# Altium schematic sheet pwm_driver.SchDoc
size A4
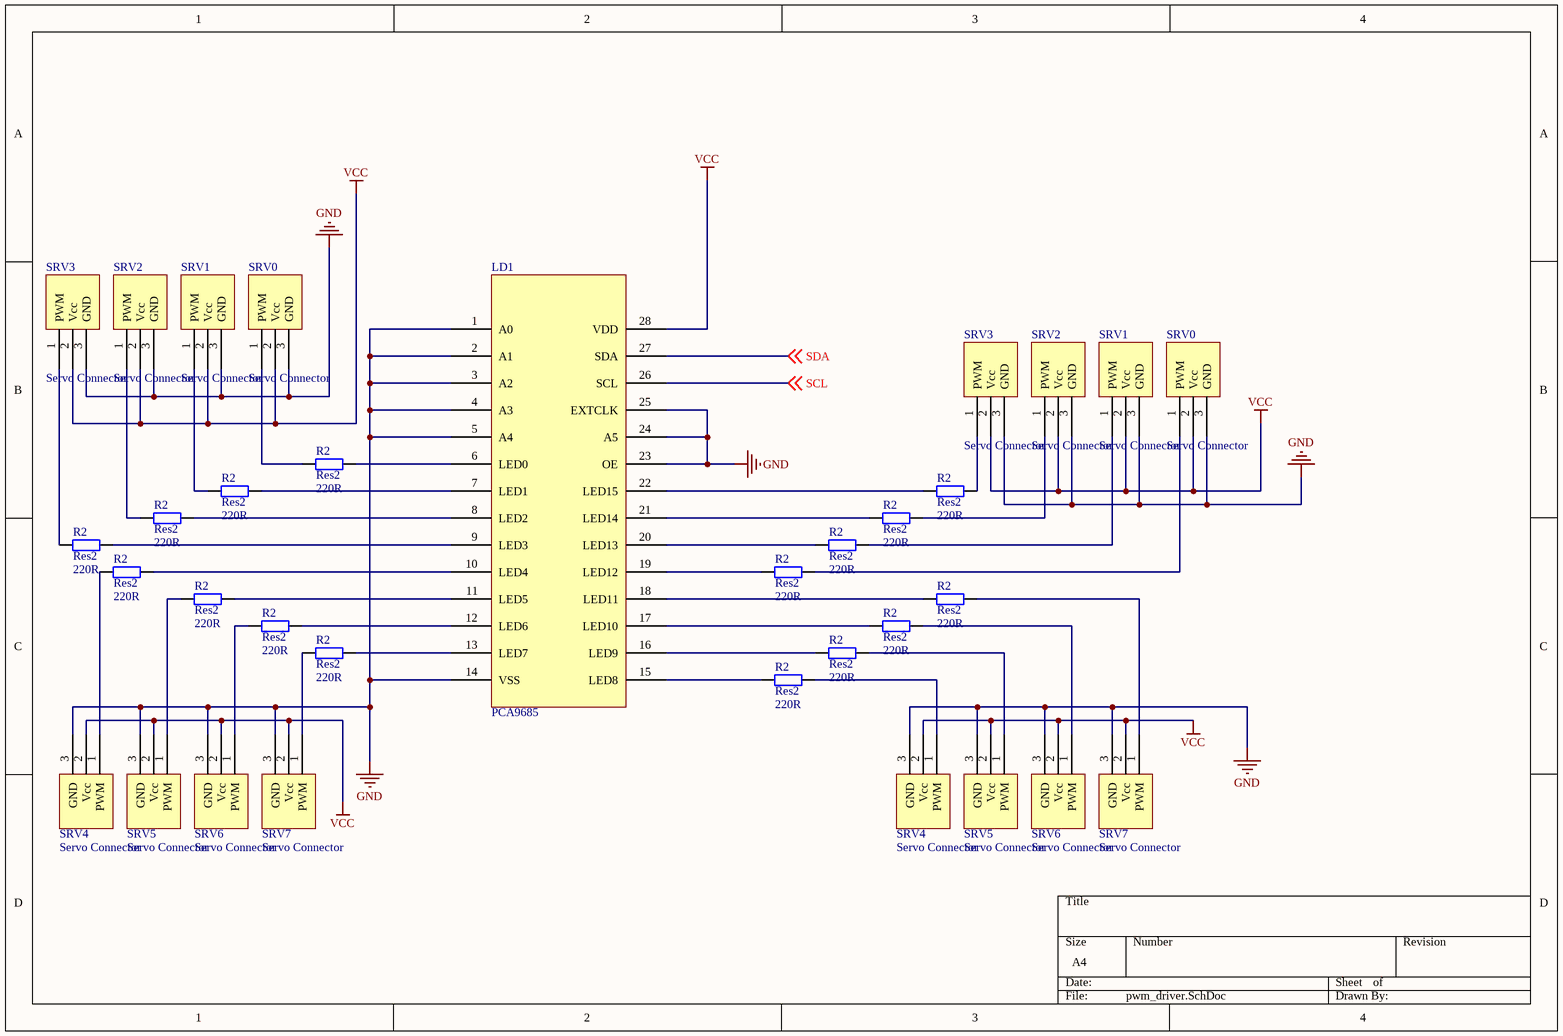
[diagram p0: pwm_driver.SchDoc]

## Parts
(Parts that share a designator on the sheet are numbered #1, #2 ... from top to bottom, then left to right.)
LD1  PCA9685
R2#1  Res2  value 220R  [AXIAL-0.4]
R2#2  Res2  value 220R  [AXIAL-0.4]
R2#3  Res2  value 220R  [AXIAL-0.4]
R2#4  Res2  value 220R  [AXIAL-0.4]
R2#5  Res2  value 220R  [AXIAL-0.4]
R2#6  Res2  value 220R  [AXIAL-0.4]
R2#7  Res2  value 220R  [AXIAL-0.4]
R2#8  Res2  value 220R  [AXIAL-0.4]
R2#9  Res2  value 220R  [AXIAL-0.4]
R2#10  Res2  value 220R  [AXIAL-0.4]
R2#11  Res2  value 220R  [AXIAL-0.4]
R2#12  Res2  value 220R  [AXIAL-0.4]
R2#13  Res2  value 220R  [AXIAL-0.4]
R2#14  Res2  value 220R  [AXIAL-0.4]
R2#15  Res2  value 220R  [AXIAL-0.4]
R2#16  Res2  value 220R  [AXIAL-0.4]
SRV0#1  Servo Connector
SRV0#2  Servo Connector
SRV1#1  Servo Connector
SRV1#2  Servo Connector
SRV2#1  Servo Connector
SRV2#2  Servo Connector
SRV3#1  Servo Connector
SRV3#2  Servo Connector
SRV4#1  Servo Connector
SRV4#2  Servo Connector
SRV5#1  Servo Connector
SRV5#2  Servo Connector
SRV6#1  Servo Connector
SRV6#2  Servo Connector
SRV7#1  Servo Connector
SRV7#2  Servo Connector

## Nets
GND: LD1.1(A0) LD1.2(A1) LD1.3(A2) LD1.4(A3) LD1.5(A4) LD1.14(VSS) LD1.23(OE) LD1.24(A5) LD1.25(EXTCLK) SRV0#1.3(GND) SRV0#2.3(GND) SRV1#1.3(GND) SRV1#2.3(GND) SRV2#1.3(GND) SRV2#2.3(GND) SRV3#1.3(GND) SRV3#2.3(GND) SRV4#1.3(GND) SRV4#2.3(GND) SRV5#1.3(GND) SRV5#2.3(GND) SRV6#1.3(GND) SRV6#2.3(GND) SRV7#1.3(GND) SRV7#2.3(GND)
VCC: LD1.28(VDD) SRV0#1.2(Vcc) SRV0#2.2(Vcc) SRV1#1.2(Vcc) SRV1#2.2(Vcc) SRV2#1.2(Vcc) SRV2#2.2(Vcc) SRV3#1.2(Vcc) SRV3#2.2(Vcc) SRV4#1.2(Vcc) SRV4#2.2(Vcc) SRV5#1.2(Vcc) SRV5#2.2(Vcc) SRV6#1.2(Vcc) SRV6#2.2(Vcc) SRV7#1.2(Vcc) SRV7#2.2(Vcc)
SCL: LD1.26(SCL) ; off-sheet SCL
SDA: LD1.27(SDA) ; off-sheet SDA
NetLD1_6: LD1.6(LED0) R2#1.2
NetLD1_7: LD1.7(LED1) R2#2.2
NetLD1_8: LD1.8(LED2) R2#4.2
NetLD1_9: LD1.9(LED3) R2#6.2
NetLD1_10: LD1.10(LED4) R2#8.2
NetLD1_11: LD1.11(LED5) R2#10.2
NetLD1_12: LD1.12(LED6) R2#12.2
NetLD1_13: LD1.13(LED7) R2#14.2
NetLD1_15: LD1.15(LED8) R2#16.1
NetLD1_16: LD1.16(LED9) R2#15.1
NetLD1_17: LD1.17(LED10) R2#13.1
NetLD1_18: LD1.18(LED11) R2#11.1
NetLD1_19: LD1.19(LED12) R2#9.1
NetLD1_20: LD1.20(LED13) R2#7.1
NetLD1_21: LD1.21(LED14) R2#5.1
NetLD1_22: LD1.22(LED15) R2#3.1
NetR2#1_1: R2#1.1 SRV0#1.1(PWM)
NetR2#2_1: R2#2.1 SRV1#1.1(PWM)
NetR2#3_2: R2#3.2 SRV3#2.1(PWM)
NetR2#4_1: R2#4.1 SRV2#1.1(PWM)
NetR2#5_2: R2#5.2 SRV2#2.1(PWM)
NetR2#6_1: R2#6.1 SRV3#1.1(PWM)
NetR2#7_2: R2#7.2 SRV1#2.1(PWM)
NetR2#8_1: R2#8.1 SRV4#1.1(PWM)
NetR2#9_2: R2#9.2 SRV0#2.1(PWM)
NetR2#10_1: R2#10.1 SRV5#1.1(PWM)
NetR2#11_2: R2#11.2 SRV7#2.1(PWM)
NetR2#12_1: R2#12.1 SRV6#1.1(PWM)
NetR2#13_2: R2#13.2 SRV6#2.1(PWM)
NetR2#14_1: R2#14.1 SRV7#1.1(PWM)
NetR2#15_2: R2#15.2 SRV5#2.1(PWM)
NetR2#16_2: R2#16.2 SRV4#2.1(PWM)

## Library data of the parts
R2#1-R2#16 = Res2: Resistor; Published: 8-Jun-2000; LatestRevisionDate: 17-Jul-2002; LatestRevisionNote: Re-released for DXP Platform.; PackageReference: AXIAL-0.4; Publisher: Altium Limited; PackageDescription: Axial Device, Thru-Hole; 2 Leads; 0.4 in Pin Spacing